# EAGLE design feeder_container_side (EAGLE 9.3.0)
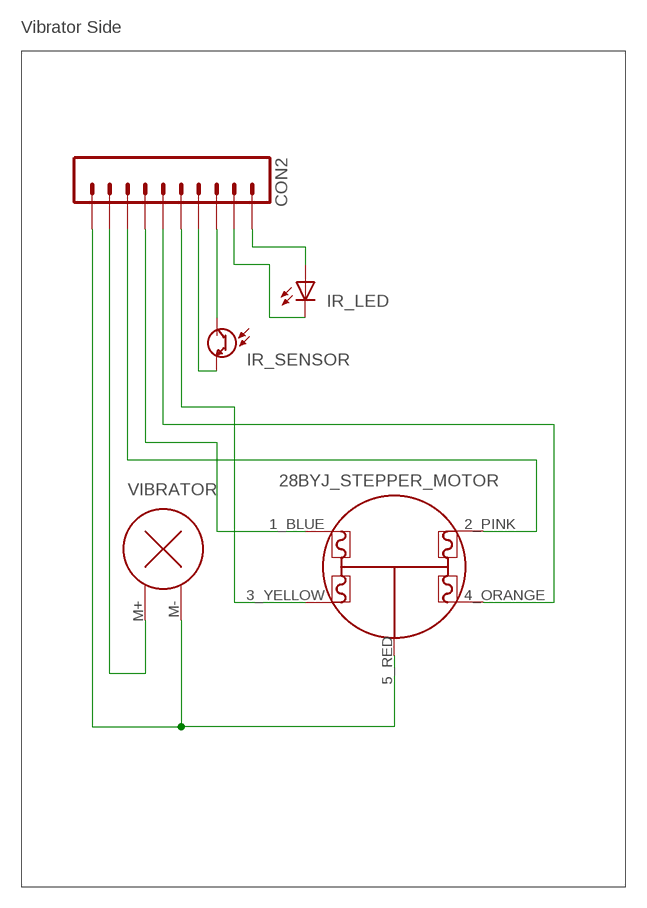
[diagram p0: schematic, sheet 1]

## Parts
28BYJ_STEPPER_MOTOR  28BYJ  [28BYJ]
CON2  CON_10  [CON_10P_1.25_ALIEXPRESS]
IR_LED  TCR5000_EMITTER  [TCR5000_IR_EMITTER]
IR_SENSOR  TCR5000_SENSOR  [TCR5000_IR_SENSOR]
VIBRATOR  VIBRATION_MOTORVIBRATION_MOTOR_LARGE  [VIBRATION_MOTOR_LARGE]

## Nets
GND: 28BYJ_STEPPER_MOTOR.5_RED(5_COM) CON2.10 VIBRATOR.M-(-)
IR+: CON2.1 IR_LED.A
IR-: CON2.2 IR_LED.C
MOTOR+: CON2.9 VIBRATOR.M+(+)
SENSOR+: CON2.3 IR_SENSOR.C
SENSOR-: CON2.4 IR_SENSOR.E
STEPPER_1: 28BYJ_STEPPER_MOTOR.1_BLUE CON2.7
STEPPER_2: 28BYJ_STEPPER_MOTOR.2_PINK CON2.8
STEPPER_3: 28BYJ_STEPPER_MOTOR.3_YELLOW CON2.5
STEPPER_4: 28BYJ_STEPPER_MOTOR.4_ORANGE CON2.6

## Notes on the sheet
- Vibrator Side

## Library data of the parts
28BYJ_STEPPER_MOTOR = Skinner_Box_Devices:28BYJ: X25168 - Miniature stepper motor for analog gauge
CON2 = Skinner_Box_Devices:CON_10
IR_LED = Skinner_Box_Devices:TCR5000_EMITTER
IR_SENSOR = Skinner_Box_Devices:TCR5000_SENSOR
VIBRATOR = Skinner_Box_Devices:VIBRATION_MOTOR

## Net classes
0 default: width 0.254 mm
1 motor: width 0.508 mm, clearance 0.254 mm

## Board
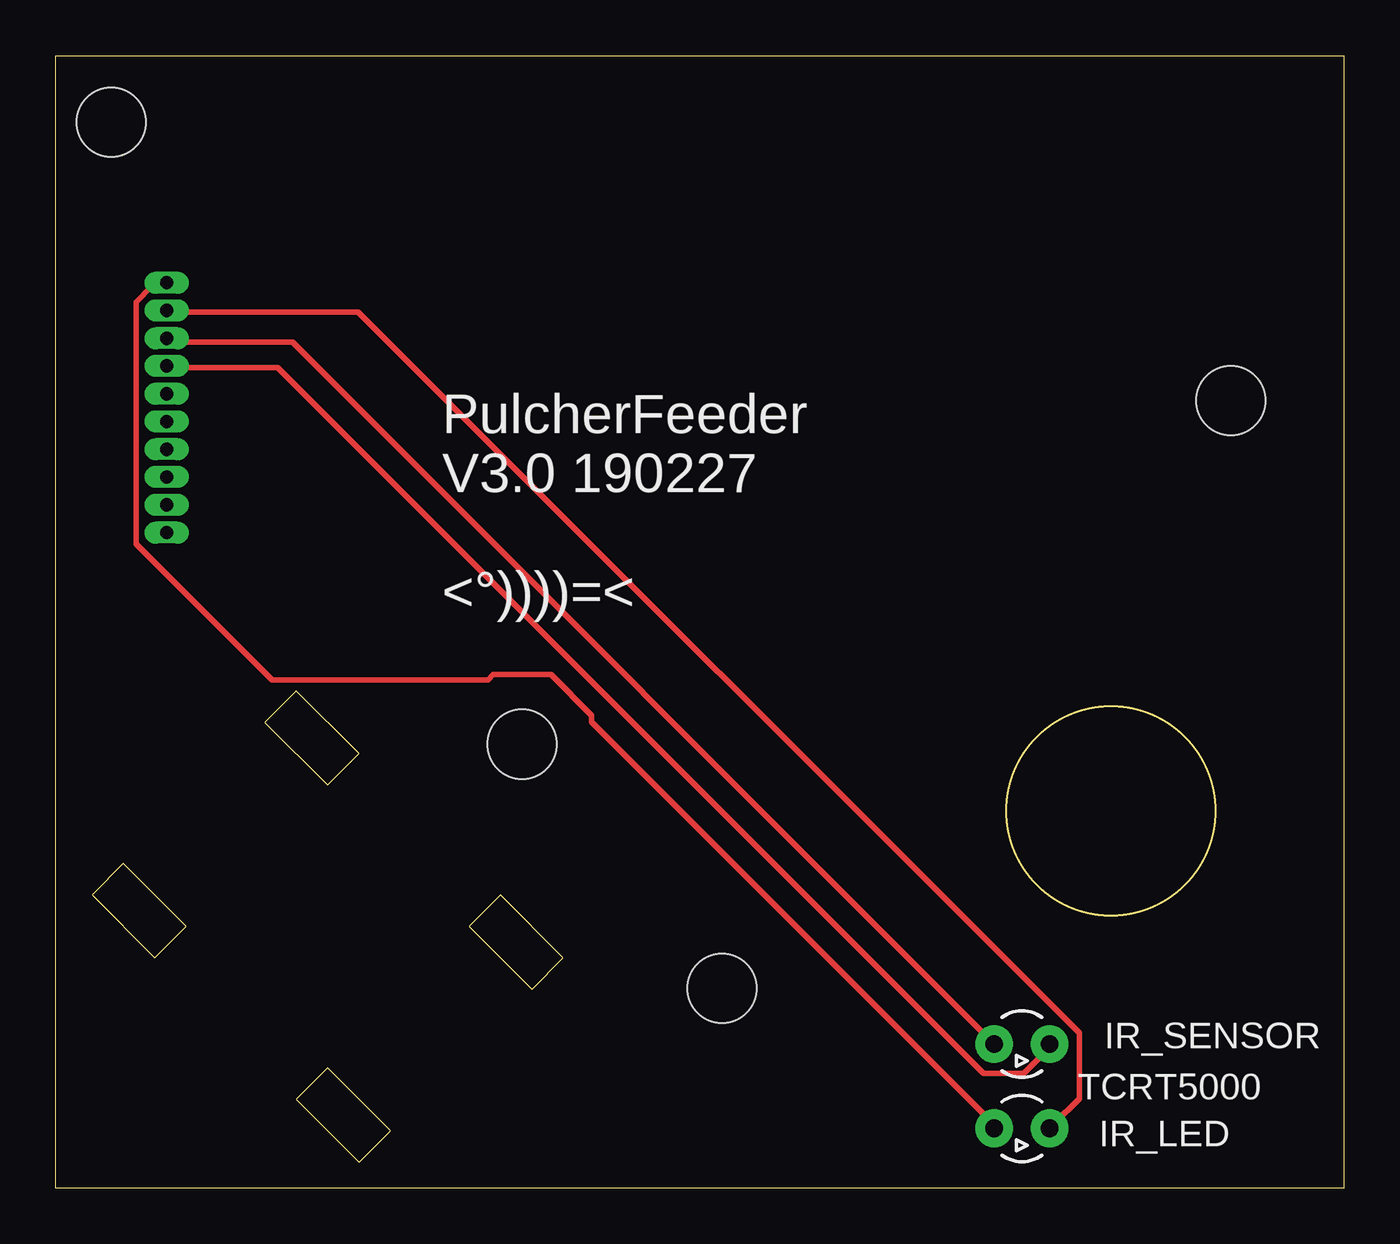
[diagram p1: board, top side]
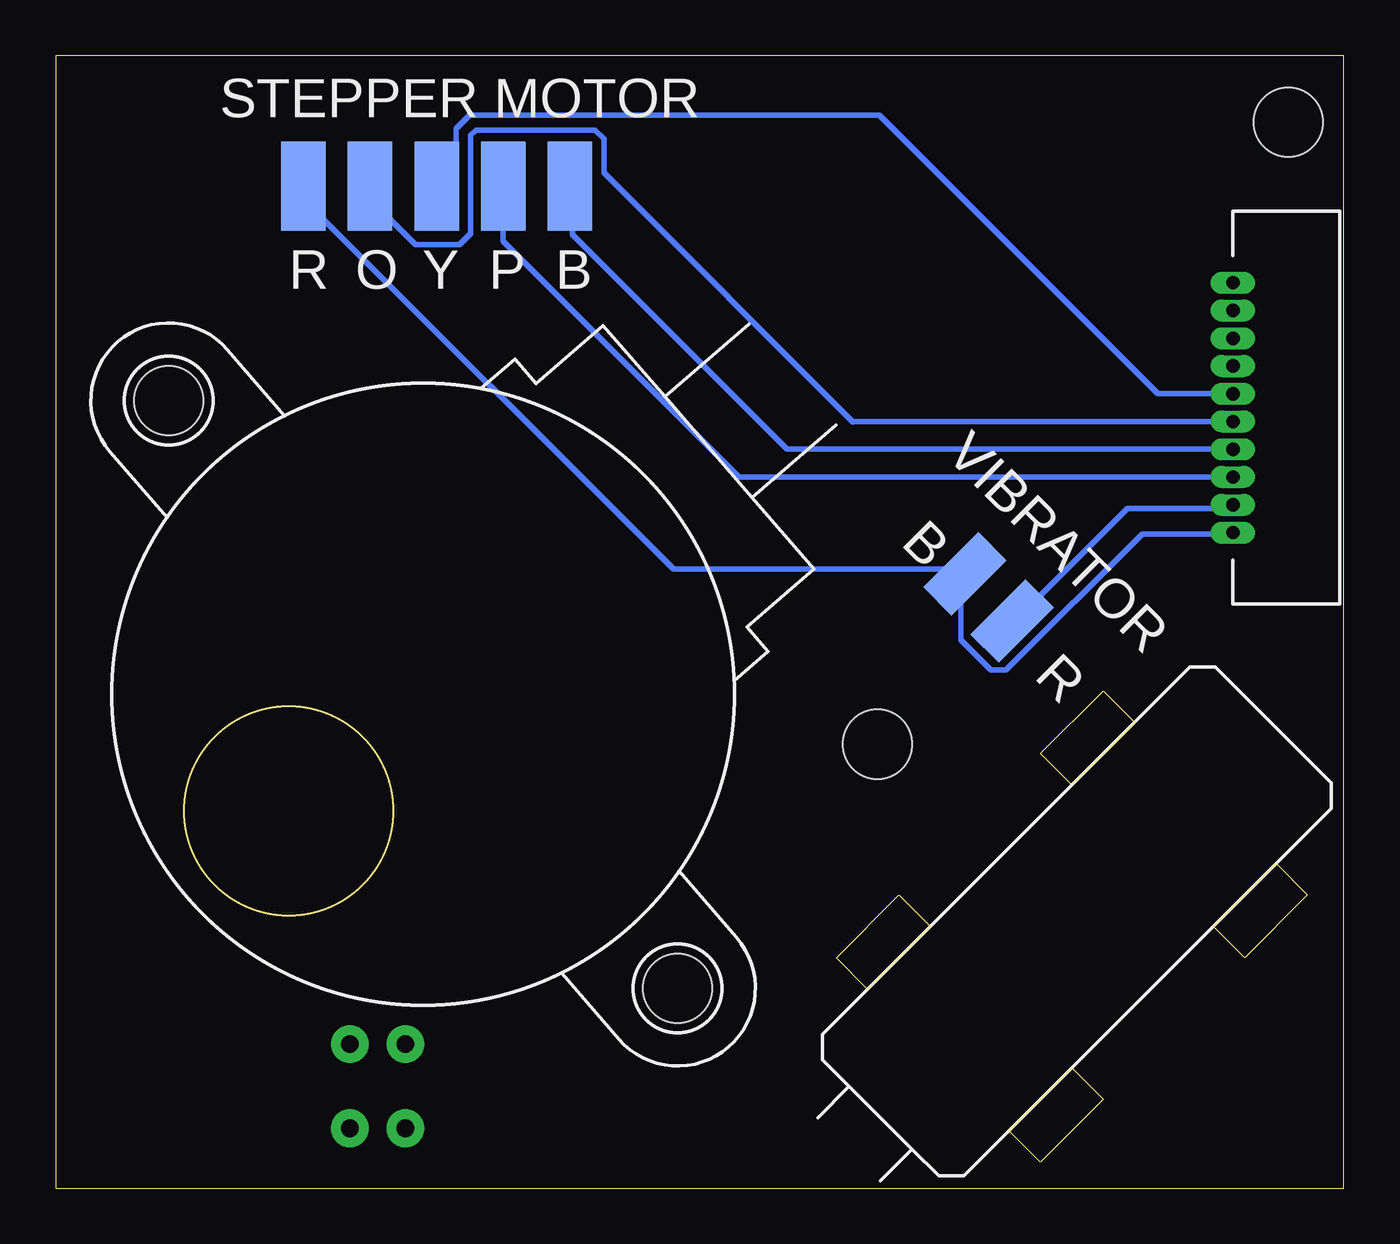
[diagram p2: board, bottom side, seen from below]

Size 58 x 51 mm. Coordinates in mm from the lower left corner, seen from the top.
Outline: 58,43 58,28
Outline: 0,0 0,51 58,51 58,0 0,0
Outline: 5.88,11.79 3.06,14.62 1.64,13.21 4.47,10.38 5.88,11.79
Outline: 10.84,22.4 9.42,20.98 12.25,18.16 13.66,19.57 10.84,22.4
Outline: 15.08,2.6 12.25,5.43 10.84,4.02 13.66,1.19 15.08,2.6
Outline: 21.44,8.96 22.86,10.38 20.03,13.21 18.61,11.79 21.44,8.96
Outline: circle at 47.5,17 radius 4.7
Copper layers (1*16): Top 0.035mm / dielectric 1.5mm / Bottom 0.035mm
Design rules "eagle_design_rules_multiCB": minimum track width 0.2mm, minimum drill 0.2mm, track to track 0.2mm, track to pad 0.2mm, pad to pad 0.2mm, via to via 0.2mm, smd to smd 0.2mm, copper to edge 0.2mm, drill to drill 0.2mm, minimum pad ring 0mil, minimum via ring 8mil, stop-mask expansion 4mil, vias tented up to drill 1mm, thermal gap 10mil
Holes 3.1 mm at 2.5,48 21,20
tRestrict: area -0.5,45 to 5.5,51; area 18,17 to 24,23
bRestrict: area -0.5,45 to 5.5,51; area 18,17 to 24,23

### Footprints (pad centres in the part's own frame; a part is rotated, then mirrored left to right if it is on the bottom)
28BYJ = smd 2 x 4 rotated 130.9 bottom: 1_BLUE -12.97,-27.979; 2_PINK -14.934,-25.712; 3_YELLOW -16.898,-23.444; 4_ORANGE -18.863,-21.177; 5_RED -20.827,-18.909 | hole 3.1: -17.5,-8; 17.5,-8
CON_10P_1.25_ALIEXPRESS = drill 0.6 pad 1 long: 1 3.225,0; 2 4.475,0; 3 5.725,0; 4 6.975,0; 5 8.225,0; 6 9.475,0; 7 10.725,0; 8 11.975,0; 9 13.225,0; 10 14.475,0
TCR5000_IR_EMITTER = drill 0.8 pad 1.7: A 0,1.25; C 0,-1.25
TCR5000_IR_SENSOR = drill 0.8 pad 1.7: C 0,1.25; E 0,-1.25
VIBRATION_MOTOR_LARGE = smd 3.5 x 1.8 bottom: M+ 7.5,-11.63; M- 7.5,-14.63

### Placement (x,y rotation side)
28BYJ_STEPPER_MOTOR  47.5,17 229.1 top
CON2  5,44 270 bottom
IR_LED  43.5,2.7 90 top
IR_SENSOR  43.5,6.5 90 top
VIBRATOR  12.02,12.02 135 top

### Tracks (layer width: path | path; a pad name or v marks a point on that pad's centre or on a via)
GND
  Bottom 0.254: CON2.10 5.22,29.47 9.08,29.47 15.21,23.34 15.89,23.34 17.25,24.7 17.25,27.65 VIBRATOR.M- 17.25,27.88 30.19,27.88 46.76,44.45 46.76,44.9 28BYJ_STEPPER_MOTOR.5_RED
IR+
  Top 0.254: CON2.1 4.99,40.59 4.31,40.59 3.63,39.91 3.63,29.01 9.76,22.88 19.46,22.88 19.7,23.13 22.3,23.13 24.13,21.3 24.13,21 42.22,2.91 IR_LED.A
IR-
  Top 0.254: CON2.2 5.22,39.45 13.62,39.45 46.08,6.99 46.08,4.04 44.95,2.91 IR_LED.C
MOTOR+
  Bottom 0.254: CON2.9 5.22,30.6 9.76,30.6 14.76,25.61 VIBRATOR.M+
SENSOR+
  Top 0.254: CON2.3 5.22,38.09 10.67,38.09 42.22,6.54 IR_SENSOR.C
SENSOR-
  Top 0.254: CON2.4 5.22,36.96 9.99,36.96 41.77,5.18 43.58,5.18 44.72,6.31 IR_SENSOR.E
STEPPER_1
  Bottom 0.254: 5.22,33.33 CON2.7 25.07,33.27 34.73,42.93 34.73,44.9 28BYJ_STEPPER_MOTOR.1_BLUE
STEPPER_2
  Bottom 0.254: CON2.8 27.23,32.02 37.84,42.64 28BYJ_STEPPER_MOTOR.2_PINK
STEPPER_3
  Bottom 0.254: 28BYJ_STEPPER_MOTOR.3_YELLOW 39.97,45.99 39.97,47.7 39.37,48.3 20.9,48.3 8.38,35.77 CON2.5
STEPPER_4
  Bottom 0.254: CON2.6 22.07,34.52 22.1,34.5 33.32,45.72 33.32,47.26 33.71,47.65 39.08,47.65 39.32,47.41 39.32,42.99 39.81,42.49 41.8,42.49 43.84,44.54 28BYJ_STEPPER_MOTOR.4_ORANGE

### Text on the board
tPlace: PulcherFeeder / V3.0 190227 / / <°))))=<
bPlace: STEPPER MOTOR | B | P | Y | O | R | VIBRATOR | B | R
tNames: TCRT5000